# Altium schematic sheet SK-PiCo.SchDoc
size A; SheetNumber: 1; SheetTotal: 4; SPICEModelCacheARYZQBPR: <root> / <DocumentId>ARYZQBPR</DocumentId> / <CacheFrame Number="0"> / <Model Name="1n4007" Kind="MDL"> / <Text>*1N4007 MCE 8-16-95 / *1000V 1A Si GenPurpose Diode pkg:DIODE0.4 1,2 / .MODEL 1N4007 D(IS=2.55E-9 RS=0.042 N=1.75 TT=5.76E-6 CJO=1.85E-11 / + VJ=0.75 M=0.333 BV=1000 IBV=9.86E-5 )</Text> / </Model> / </CacheFrame> / </root>
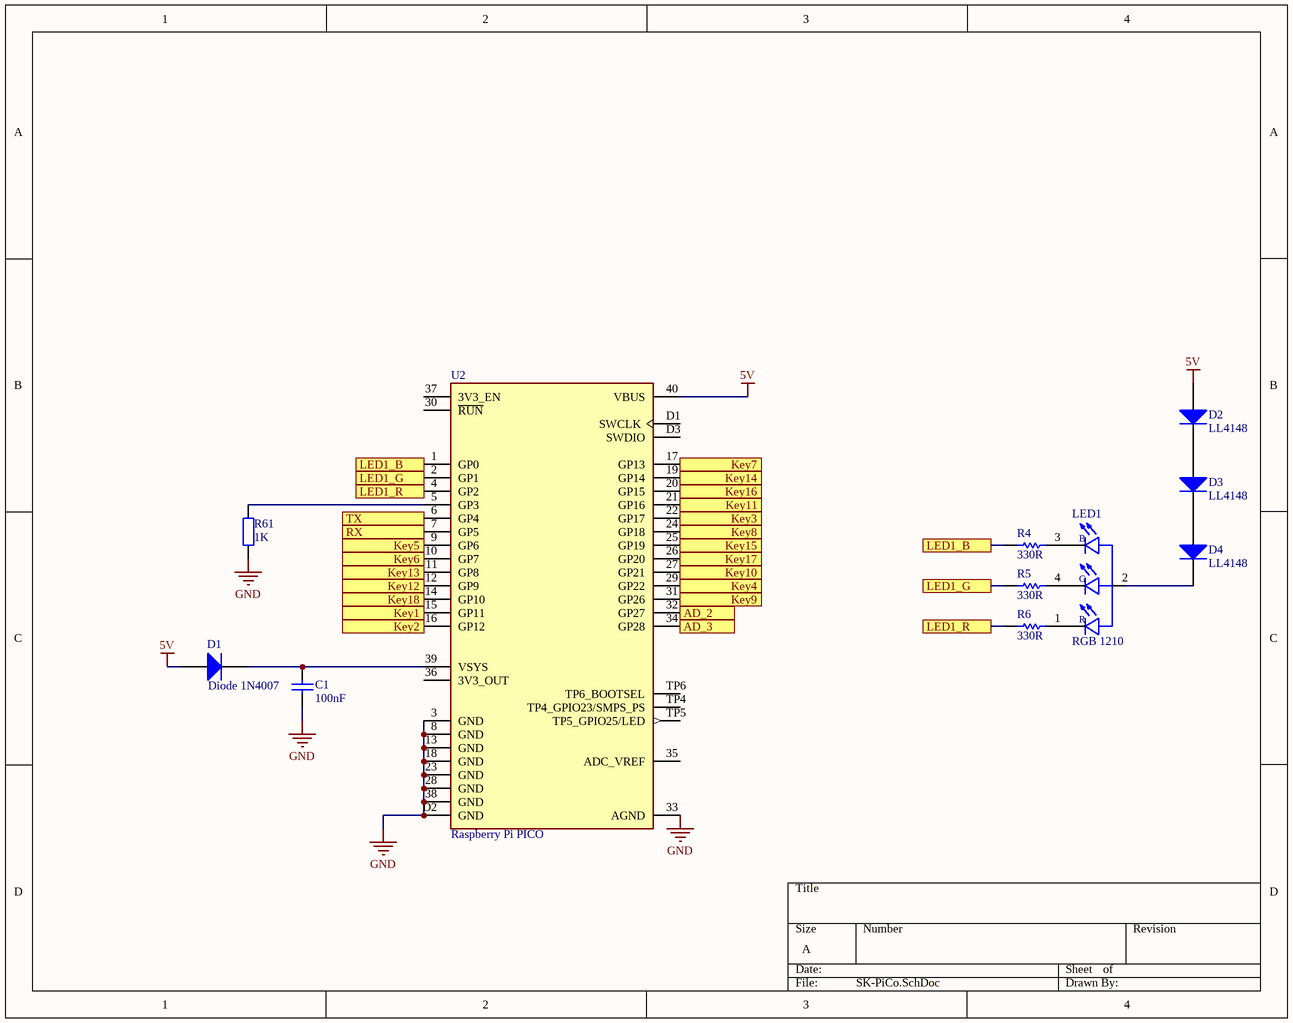
[diagram p0: SK-PiCo.SchDoc]

## Parts
C1  100nF  [SMH_RES0805-STD]
D1  Diode 1N4007  [SMH_SMA]
D2  LL4148  [SMH_MINIMELF]
D3  LL4148  [SMH_MINIMELF]
D4  LL4148  [SMH_MINIMELF]
LED1  RGB 1210  [SMH_LED_1210-RGB]
R4  330R  [SMH_1206STD]
R5  330R  [SMH_1206STD]
R6  330R  [SMH_1206STD]
R61  1K  [SMH_RES0805-STD]
U2  Raspberry Pi PICO  [SMH_PicoPi]

## Ports
AD_2, AD_3, Key1, Key2, Key3, Key4, Key5, Key6, Key7, Key8, Key9, Key10, Key11, Key12, Key13, Key14, Key15, Key16, Key17, Key18, LED1_B, LED1_G, LED1_R, RX, TX

## Nets
5V: D1.1(A) D2.1(A) U2.40(VBUS)
GND: C1.2 R61.2 U2.3(GND) U2.8(GND) U2.13(GND) U2.18(GND) U2.23(GND) U2.28(GND) U2.33(AGND) U2.38(GND) U2.D2(GND)
AD_2: U2.32(GP27) ; port AD_2
AD_3: U2.34(GP28) ; port AD_3
Key1: U2.15(GP11) ; port Key1
Key2: U2.16(GP12) ; port Key2
Key3: U2.22(GP17) ; port Key3
Key4: U2.29(GP22) ; port Key4
Key5: U2.9(GP6) ; port Key5
Key6: U2.10(GP7) ; port Key6
Key7: U2.17(GP13) ; port Key7
Key8: U2.24(GP18) ; port Key8
Key9: U2.31(GP26) ; port Key9
Key10: U2.27(GP21) ; port Key10
Key11: U2.21(GP16) ; port Key11
Key12: U2.12(GP9) ; port Key12
Key13: U2.11(GP8) ; port Key13
Key14: U2.19(GP14) ; port Key14
Key15: U2.25(GP19) ; port Key15
Key16: U2.20(GP15) ; port Key16
Key17: U2.26(GP20) ; port Key17
Key18: U2.14(GP10) ; port Key18
LED1_B: R4.2 U2.1(GP0) ; port LED1_B
LED1_G: R5.2 U2.2(GP1) ; port LED1_G
LED1_R: R6.2 U2.4(GP2) ; port LED1_R
RX: U2.7(GP5) ; port RX
TX: U2.6(GP4) ; port TX
NetC1_1: C1.1 D1.2(K) U2.39(VSYS)
NetD2_2: D2.2(K) D3.1(A)
NetD3_2: D3.2(K) D4.1(A)
NetD4_2: D4.2(K) LED1.2(Anode)
NetLED1_1: LED1.1(R) R6.1
NetLED1_3: LED1.3(B) R4.1
NetLED1_4: LED1.4(G) R5.1
NetR61_1: R61.1 U2.5(GP3)

Not connected (* = marked no-connect by the designer): U2 30(~{RUN}) 35(ADC_VREF) 36(3V3_OUT) 37(3V3_EN) D1(SWCLK) D3(SWDIO) TP4(TP4_GPIO23/SMPS_PS) TP5(TP5_GPIO25/LED) TP6(TP6_BOOTSEL)

## Library data of the parts
C1 = Cap: Capacitor; Published: 8-Jun-2000; LatestRevisionDate: 17-Jul-2002; LatestRevisionNote: Re-released for DXP Platform.; PackageReference: RAD-0.3; Publisher: Altium Limited; Value: 100nF
D1 = Diode 1N4007: 1 Amp General Purpose Rectifier; Published: 8-Jun-2000; LatestRevisionDate: 17-Jul-2002; LatestRevisionNote: Re-released for DXP Platform.; DatasheetVersion: 1998; PackageVersion: Aug-1999; PackageReference: DO-41; Publisher: Altium Limited; PackageDescription: Diode, Axial; Body 5.2 x 2.7 mm (LxDia. max), Lead Dia. 0.86 mm (max); Code_JEDEC: DO-204-AL; ComponentLink1Description: Manufacturer Link; ComponentLink1URL: http://www.fairchildsemi.com/; ComponentLink2Description: Datasheet; ComponentLink2URL: http://www.fairchildsemi.com/ds/1N%2F1N4001.pdf
D2-D4 = Diode 1N4004: 1 Amp General Purpose Rectifier; Published: 8-Jun-2000; LatestRevisionDate: 17-Jul-2002; LatestRevisionNote: Re-released for DXP Platform.; DatasheetVersion: 1998; PackageVersion: Aug-1999; PackageReference: DO-41; Publisher: Altium Limited; PackageDescription: Diode, Axial; Body 5.2 x 2.7 mm (LxDia. max), Lead Dia. 0.86 mm (max); Code_JEDEC: DO-204-AL; ComponentLink1Description: Manufacturer Link; ComponentLink1URL: http://www.fairchildsemi.com/; ComponentLink2Description: Datasheet; ComponentLink2URL: http://www.fairchildsemi.com/ds/1N%2F1N4001.pdf
LED1 = LED RGB: Value: RGB 1210
R4-R6 = Res1: Resistor; Published: 8-Jun-2000; LatestRevisionDate: 17-Jul-2002; LatestRevisionNote: Re-released for DXP Platform.; PackageReference: AXIAL-0.3; Publisher: Altium Limited; PackageDescription: Axial Device, Thru-Hole; 2 Leads; 0.3 in Pin Spacing; Value: 330R
R61 = Res2: Resistor; Published: 8-Jun-2000; LatestRevisionDate: 17-Jul-2002; LatestRevisionNote: Re-released for DXP Platform.; PackageReference: AXIAL-0.4; Publisher: Altium Limited; PackageDescription: Axial Device, Thru-Hole; 2 Leads; 0.4 in Pin Spacing; Value: 1K
U2 = PICO Pi: Value: Raspberry Pi PICO